# EAGLE schematic STM32_CAN-USB (EAGLE 7.5.0)
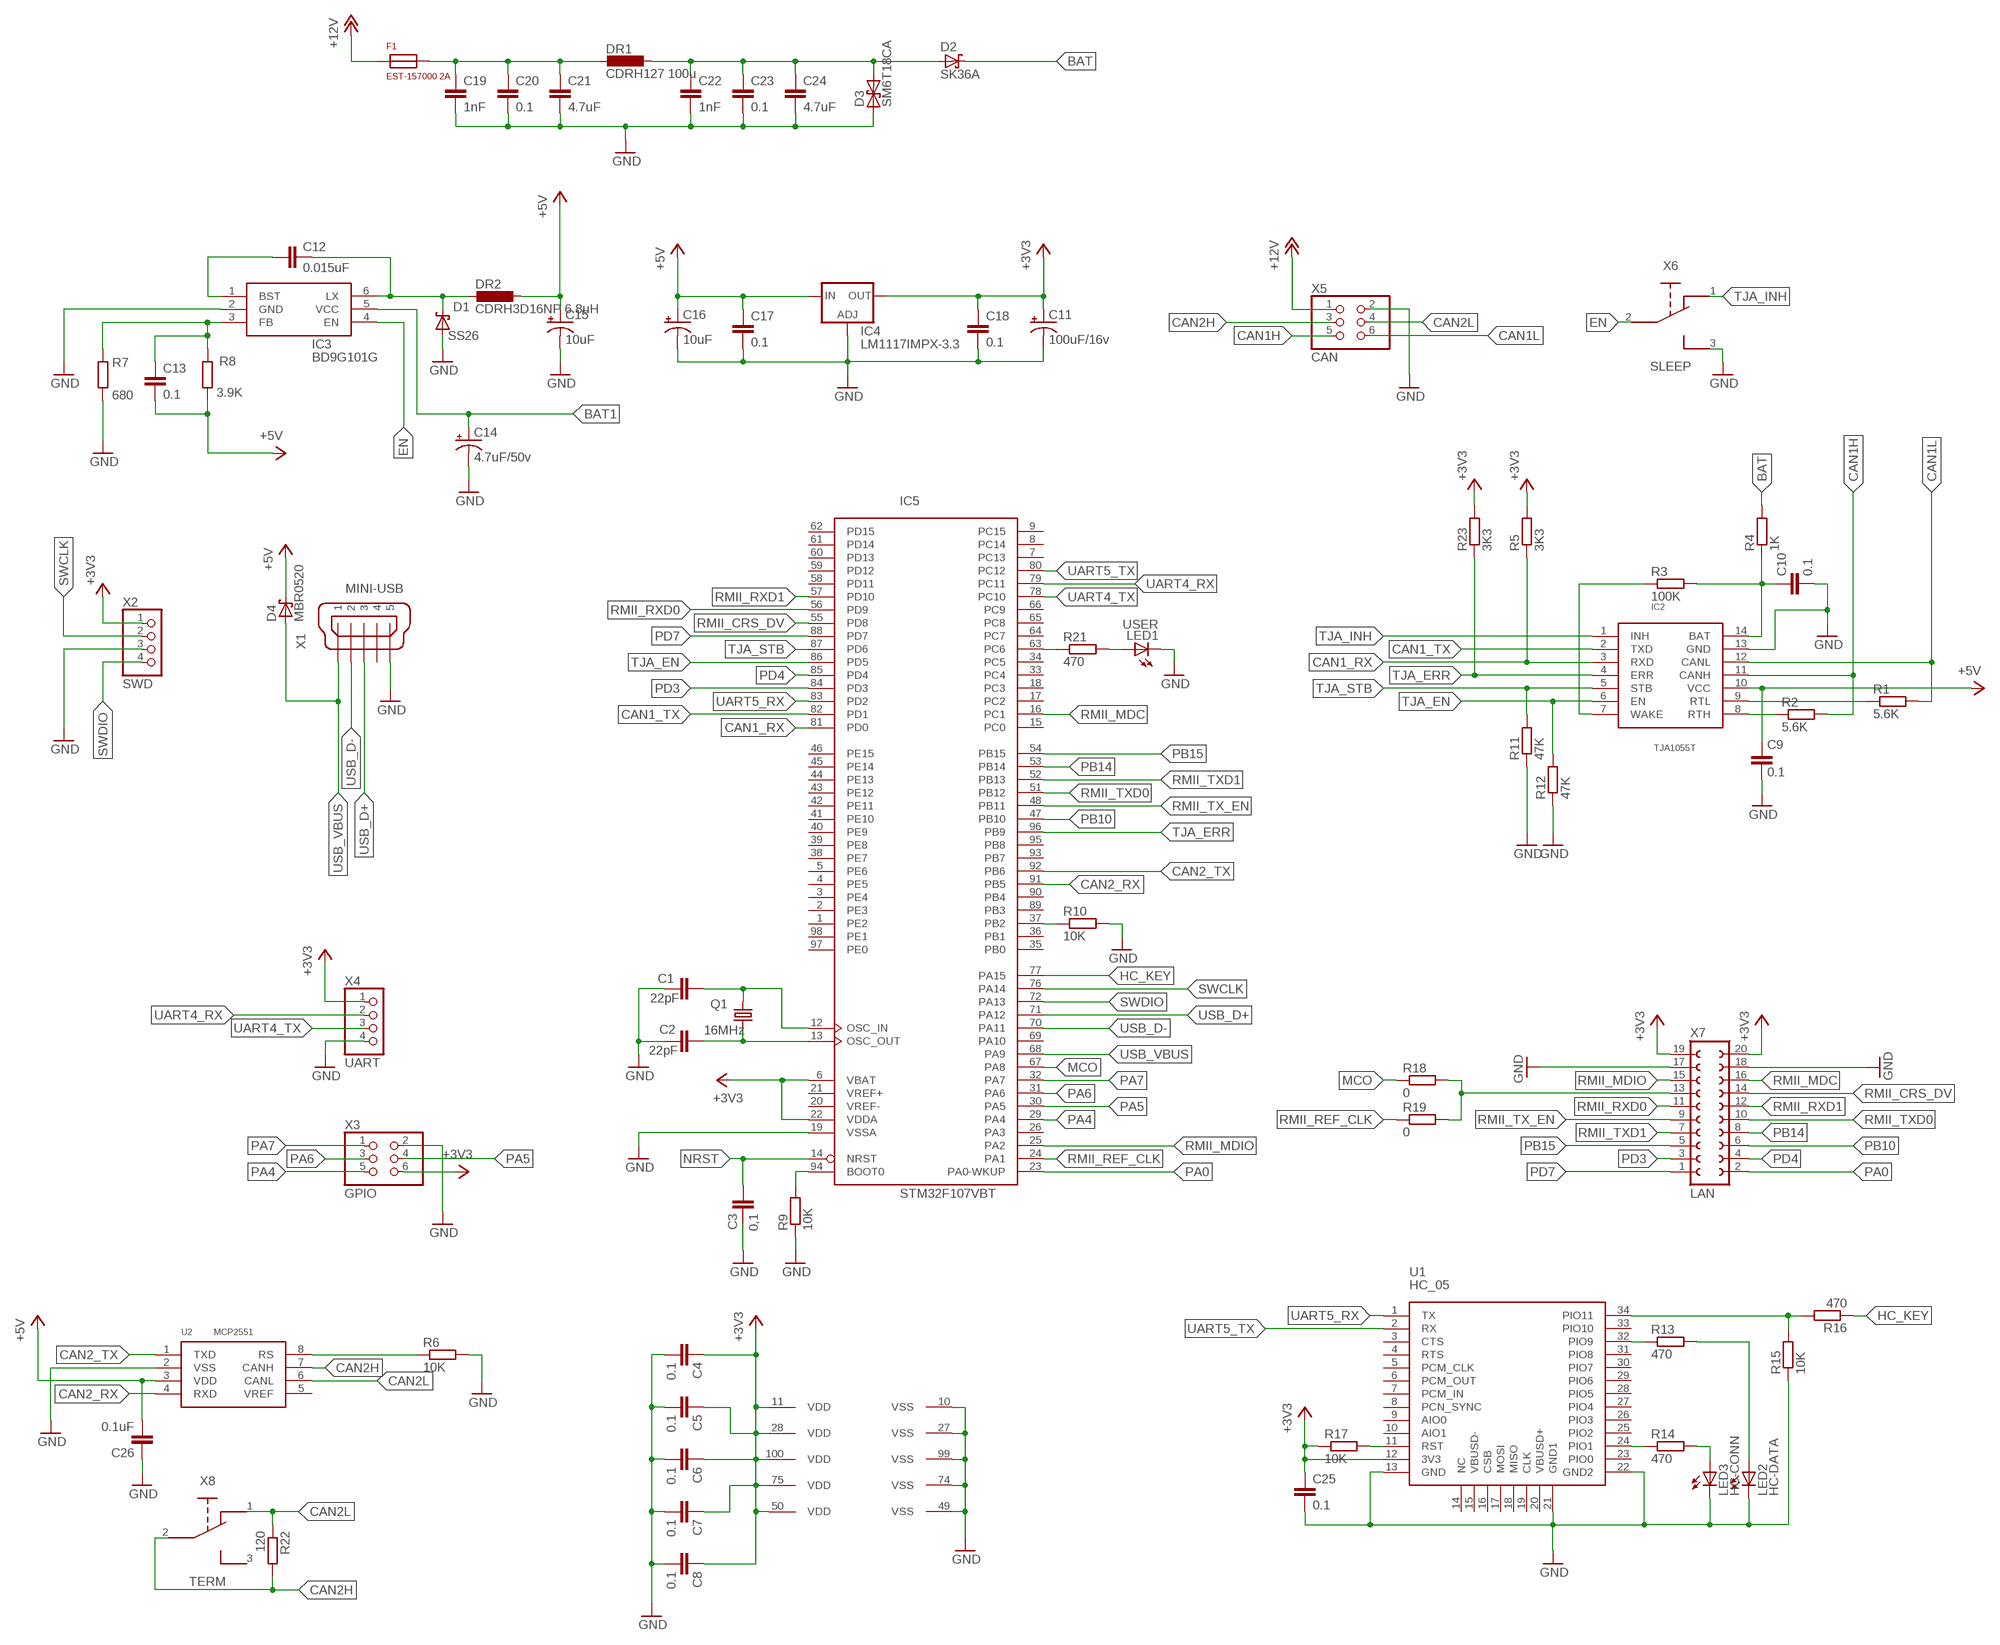
[diagram p0: schematic, sheet 1]

## Parts
C1  22pF  C-EUC0805  [C0805]
C2  22pF  C-EUC0805  [C0805]
C3  0,1  C-EUC0805  [C0805]
C4  0.1  C-EUC0805  [C0805]
C5  0.1  C-EUC0805  [C0805]
C6  0.1  C-EUC0805  [C0805]
C7  0.1  C-EUC0805  [C0805]
C8  0.1  C-EUC0805  [C0805]
C9  0.1  C-EUC0805  [C0805]
C10  0.1  C-EUC0805  [C0805]
C11  100uF/16v  CPOL-US153CLV-0605  [153CLV-0605]
C12  0.015uF  C-EUC0805  [C0805]
C13  0.1  C-EUC0805  [C0805]
C14  4.7uF/50v  CPOL-US153CLV-0605  [153CLV-0605]
C15  10uF  CPOL-US153CLV-0605  [153CLV-0605]
C16  10uF  CPOL-US153CLV-0605  [153CLV-0605]
C17  0.1  C-EUC0805  [C0805]
C18  0.1  C-EUC0805  [C0805]
C19  1nF  C-EUC0805  [C0805]
C20  0.1  C-EUC0805  [C0805]
C21  4.7uF  C-EUC0805  [C0805]
C22  1nF  C-EUC0805  [C0805]
C23  0.1  C-EUC0805  [C0805]
C24  4.7uF  C-EUC0805  [C0805]
C25  0.1  C-EUC0805  [C0805]
C26  0.1uF  C-EUC0805  [C0805]
D1  SS26  SCHOTTKY-DIODESMD  [SMB]
D2  SK36A  [DO-214AC]
D3  SM6T18CA  [DO214AA]
D4  MBR0520  [SOD123]
DR1  CDRH127 100u  CDRH127  [MS85]
DR2  CDRH3D16NP 6.8uH  CDRH3D16NP  [CDRH3D16NP]
F1  EST-157000 2A  FUSE  [FUSE]
IC2  TJA1055T  TJA1054T  [SO-14W]
IC3  BD9G101G  [SSOP6]
IC4  LM1117IMPX-3.3  [SOT223]
IC5  STM32F107VBT  [LQFP100]
LED1  USER  LED3MM  [LED3MM]
LED2  HC-DATA  LED3MM  [LED3MM]
LED3  HC-CONN  LED3MM  [LED3MM]
Q1  16MHz  CRYSTALHC49UP  [HC49UP]
R1  5.6K  R-EU_R0805  [R0805]
R2  5.6K  R-EU_R0805  [R0805]
R3  100K  R-EU_R0805  [R0805]
R4  1K  R-EU_R0805  [R0805]
R5  3K3  R-EU_R0805  [R0805]
R6  10K  R-EU_R0805  [R0805]
R7  680  R-EU_R0805  [R0805]
R8  3.9K  R-EU_R0805  [R0805]
R9  10K  R-EU_R0805  [R0805]
R10  10K  R-EU_R0805  [R0805]
R11  47K  R-EU_R0805  [R0805]
R12  47K  R-EU_R0805  [R0805]
R13  470  R-EU_R0805  [R0805]
R14  470  R-EU_R0805  [R0805]
R15  10K  R-EU_R0805  [R0805]
R16  470  R-EU_R0805  [R0805]
R17  10K  R-EU_R0805  [R0805]
R18  0  R-EU_R0805  [R0805]
R19  0  R-EU_R0805  [R0805]
R21  470  R-EU_R0805  [R0805]
R22  120  R-EU_R0805  [R0805]
R23  3K3  R-EU_R0805  [R0805]
U1  HC_05  [BLUETOOTH_SMD]
U2  MCP2551  INTERFACE-MCP2551-I/SN(SOIC8)  [SO08]
X1  MINI-USB  MINI-USB-UX60-MB-5ST  [UX60-MB-5ST]
X2  SWD  PINHD-1X4  [1X04]
X3  GPIO  PINHD-2X3/90  [2X03/90]
X4  UART  PINHD-1X4/90  [1X04/90]
X5  CAN  PINHD-2X3/90  [2X03/90]
X6  SLEEP  SS12F27  [SS12F27]
X7  LAN  FE10-2W  [FE10-2W]
X8  TERM  SS12F27  [SS12F27]

## Nets
+3V3: C4.1 C5.1 C6.1 C7.1 C8.1 C11.+ C18.1 C25.1 IC4.2(OUT) IC4.4(OUT) IC5.6(VBAT) IC5.11(VDD) IC5.22(VDDA) IC5.28(VDD) IC5.50(VDD) IC5.75(VDD) IC5.100(VDD) R5.2 R17.1 R23.2 U1.12(3V3) X2.1 X3.6 X4.1 X7.19 X7.20
+5V: C9.1 C13.2 C15.+ C16.+ C17.1 C26.2 D4.C DR2.P$2 IC2.10(VCC) IC4.3(IN) R8.1 U2.3(VDD)
+12V: F1.P$1 X5.1
BAT: D2.C R4.2
BAT1: C14.+ C22.1 C23.1 C24.1 D2.A D3.C DR1.P$2 IC3.5(VCC)
BD9-FB: C13.1 IC3.3(FB) R7.2 R8.2
CAN1_RX: IC2.3(RXD) IC5.81(PD0) R5.1
CAN1_TX: IC2.2(TXD) IC5.82(PD1)
CAN1H: IC2.11(CANH) R2.2 X5.5
CAN1L: IC2.12(CANL) R1.2 X5.6
CAN2_RX: IC5.91(PB5) U2.4(RXD)
CAN2_TX: IC5.92(PB6) U2.1(TXD)
CAN2H: R22.2 U2.7(CANH) X5.3 X8.2
CAN2L: R22.1 U2.6(CANL) X5.4 X8.1
EN: IC3.4(EN) X6.2
GND: C1.2 C2.2 C3.1 C4.2 C5.2 C6.2 C7.2 C8.2 C9.2 C10.2 C11.- C14.- C15.- C16.- C17.2 C18.2 C19.2 C20.2 C21.2 C22.2 C23.2 C24.2 C25.2 C26.1 D1.A D3.A IC2.13(GND) IC3.2(GND) IC4.1(ADJ) IC5.10(VSS) IC5.19(VSSA) IC5.27(VSS) IC5.49(VSS) IC5.74(VSS) IC5.99(VSS) LED1.K(C) LED2.K(C) LED3.K(C) R6.2 R7.1 R9.1 R10.2 R11.1 R12.1 R15.1 U1.13(GND) U1.21(GND1) U1.22(GND2) U2.2(VSS) X1.5 X1.M1 X1.M2 X2.3 X3.2 X4.4 X5.2 X6.3 X7.17 X7.18
HC_KEY: IC5.77(PA15) R16.1
MCO: IC5.67(PA8) R18.1
N$1: C1.1 IC5.12(OSC_IN) Q1.2
N$2: C2.1 IC5.13(OSC_OUT) Q1.1
N$3: IC5.94(BOOT0) R9.2
N$4: IC5.37(PB2) R10.1
N$5: R6.1 U2.8(RS)
N$6: IC5.63(PC6) R21.1
N$7: IC2.8(RTH) R2.1
N$8: IC2.9(RTL) R1.1
N$9: C12.1 IC3.1(BST)
N$12: C12.2 D1.C DR2.P$1 IC3.6(LX)
N$14: LED1.A R21.2
N$18: C19.1 C20.1 C21.1 DR1.P$1 F1.P$2
N$20: R13.1 U1.32(PIO9)
N$21: R14.1 U1.24(PIO1)
N$22: LED2.A R13.2
N$23: LED3.A R14.2
N$24: R17.2 U1.11(RST)
N$25: R15.2 R16.2 U1.34(PIO11)
N$37: R18.2 R19.2 X7.13
NRST: C3.2 IC5.14(NRST)
PA0: IC5.23(PA0-WKUP) X7.2
PA4: IC5.29(PA4) X3.5
PA5: IC5.30(PA5) X3.4
PA6: IC5.31(PA6) X3.3
PA7: IC5.32(PA7) X3.1
PB10: IC5.47(PB10) X7.6
PB14: IC5.53(PB14) X7.8
PB15: IC5.54(PB15) X7.5
PD3: IC5.84(PD3) X7.3
PD4: IC5.85(PD4) X7.4
PD7: IC5.88(PD7) X7.1
RMII_CRS_DV: IC5.55(PD8) X7.14
RMII_MDC: IC5.16(PC1) X7.16
RMII_MDIO: IC5.25(PA2) X7.15
RMII_REF_CLK: IC5.24(PA1) R19.1
RMII_RXD0: IC5.56(PD9) X7.11
RMII_RXD1: IC5.57(PD10) X7.12
RMII_TX_EN: IC5.48(PB11) X7.9
RMII_TXD0: IC5.51(PB12) X7.10
RMII_TXD1: IC5.52(PB13) X7.7
SWCLK: IC5.76(PA14) X2.2
SWDIO: IC5.72(PA13) X2.4
TJA_EN: IC2.6(EN) IC5.86(PD5) R12.2
TJA_ERR: IC2.4(ERR) IC5.96(PB9) R23.1
TJA_INH: IC2.1(INH) X6.1
TJA_STB: IC2.5(STB) IC5.87(PD6) R11.2
TJABAT: C10.1 IC2.14(BAT) R3.2 R4.1
TJAWAKE: IC2.7(WAKE) R3.1
UART4_RX: IC5.79(PC11) X4.2
UART4_TX: IC5.78(PC10) X4.3
UART5_RX: IC5.83(PD2) U1.1(TX)
UART5_TX: IC5.80(PC12) U1.2(RX)
USB_D+: IC5.71(PA12) X1.3
USB_D-: IC5.70(PA11) X1.2
USB_VBUS: D4.A IC5.68(PA9) X1.1
Unconnected: IC5.1(PE2) IC5.2(PE3) IC5.3(PE4) IC5.4(PE5) IC5.5(PE6) IC5.7(PC13) IC5.8(PC14) IC5.9(PC15) IC5.15(PC0) IC5.17(PC2) IC5.18(PC3) IC5.26(PA3) IC5.33(PC4) IC5.34(PC5) IC5.35(PB0) IC5.36(PB1) IC5.38(PE7) IC5.39(PE8) IC5.40(PE9) IC5.41(PE10) IC5.42(PE11) IC5.43(PE12) IC5.44(PE13) IC5.45(PE14) IC5.46(PE15) IC5.58(PD11) IC5.59(PD12) IC5.60(PD13) IC5.61(PD14) IC5.62(PD15) IC5.64(PC7) IC5.65(PC8) IC5.66(PC9) IC5.69(PA10) IC5.89(PB3) IC5.90(PB4) IC5.93(PB7) IC5.95(PB8) IC5.97(PE0) IC5.98(PE1) U1.3(CTS) U1.4(RTS) U1.5(PCM_CLK) U1.6(PCM_OUT) U1.7(PCM_IN) U1.8(PCN_SYNC) U1.9(AIO0) U1.10(AIO1) U1.14(NC) U1.15(VBUSD-) U1.16(CSB) U1.17(MOSI) U1.18(MISO) U1.19(CLK) U1.20(VBUSD+) U1.23(PIO0) U1.25(PIO2) U1.26(PIO3) U1.27(PIO4) U1.28(PIO5) U1.29(PIO6) U1.30(PIO7) U1.31(PIO8) U1.33(PIO10) U2.5(VREF) X1.4 X8.3

## Power pins joined to a net without a drawn wire
VREF+: IC5.21(VREF+)
VREF-: IC5.20(VREF-)

## Library data of the parts
C1-C10 C12 C13 C17-C26 = rcl:C-EU: CAPACITOR, European symbol
C11 C14-C16 = rcl:CPOL-US: POLARIZED CAPACITOR, American symbol
D1 = STM32_CAN-USB:SCHOTTKY-DIODE: Schottky Diode
D2 = STM32_CAN-USB:SK36A
D3 = STM32_CAN-USB:SM6T18CA
D4 = STM32_CAN-USB:MBR0520
DR1 = STM32_CAN-USB:CDRH127
DR2 = STM32_CAN-USB:CDRH3D16NP
F1 = STM32_CAN-USB:FUSE
IC2 = STM32_CAN-USB:TJA1054T
IC3 = STM32_CAN-USB:BD9G101G
IC4 = STM32_CAN-USB:LM1117IMPX-3.3
IC5 = micro-stm_v2:STM32F107V*T: ARM 32-bit Cortex™-M3 CPU 72 MHz maximum frequency 128 to 256 Kbytes of Flash memory 64 kbytes of SRAM 80 GPIOs 2.0 to 3.6 V application supply
LED1-LED3 = led:LED: LED OSRAM: - CHIPLED LG R971, LG N971, LY N971, LG Q971, LY Q971, LO R971, LY R971 LH N974, LH R974 LS Q976, LO Q976, LY Q976 LO Q996 - Hyper CHIPLED LW Q18S LB Q993, LB Q99A, LB R99A - SideLED LS A670, LO A670, LY A670, LG A670, LP A670 LB A673, LV A673, LT A673, LW A673 LH A674 LY A675 LS A676, LA A676, LO A676, LY A676, LW A676 LS A679, LY A679, LG A679 - Hyper Micro SIDELED® LS Y876, LA Y876, LO Y876, LY Y876 LT Y87S - SmartLED LW L88C, LW L88S LB L89C, LB L89S, LG L890 LS L89K, LO L89K, LY L89K LS L896, LA L896, LO L896, LY L896 - TOPLED LS T670, LO T670, LY T670, LG T670, LP T670 LSG T670, LSP T670, LSY T670, LOP T670, LYG T670 LG T671, LOG T671, LSG T671 LB T673, LV T673, LT T673, LW T673 LH T674 LS T676, LA T676, LO T676, LY T676, LB T676, LH T676, LSB T676, LW T676 LB T67C, LV T67C, LT T67C, LS T67K, LO T67K, LY T67K, LW E67C LS E67B, LA E67B, LO E67B, LY E67B, LB E67C, LV E67C, LT E67C LW T67C LS T679, LY T679, LG T679 LS T770, LO T770, LY T770, LG T770, LP T770 LB T773, LV T773, LT T773, LW T773 LH T774 LS E675, LA E675, LY E675, LS T675 LS T776, LA T776, LO T776, LY T776, LB T776 LHGB T686 LT T68C, LB T68C - Hyper Mini TOPLED® LB M676 - Mini TOPLED Santana® LG M470 LS M47K, LO M47K, LY M47K Source: http://www.osram.convergy.de LUXEON: - LUMILED® LXK2-PW12-R00, LXK2-PW12-S00, LXK2-PW14-U00, LXK2-PW14-V00 LXK2-PM12-R00, LXK2-PM12-S00, LXK2-PM14-U00 LXK2-PE12-Q00, LXK2-PE12-R00, LXK2-PE12-S00, LXK2-PE14-T00, LXK2-PE14-U00 LXK2-PB12-K00, LXK2-PB12-L00, LXK2-PB12-M00, LXK2-PB14-N00, LXK2-PB14-P00, LXK2-PB14-Q00 LXK2-PR12-L00, LXK2-PR12-M00, LXK2-PR14-Q00, LXK2-PR14-R00 LXK2-PD12-Q00, LXK2-PD12-R00, LXK2-PD12-S00 LXK2-PH12-R00, LXK2-PH12-S00 LXK2-PL12-P00, LXK2-PL12-Q00, LXK2-PL12-R00 Source: www.luxeon.com KINGBRIGHT: KA-3528ASYC Source: www.kingbright.com
Q1 = crystal:CRYSTAL: CRYSTAL; OC_FARNELL: unknown; OC_NEWARK: unknown
R1-R19 R21-R23 = rcl:R-EU_: RESISTOR, European symbol
U1 = Bluetooth HC-05:HC_05: HC-05 Bluetooth Module
U2 = CAN_Shiel_Lib:INTERFACE-MCP2551-I/SN(SOIC8): 310070024; MPN: MCP2551-I/SN; VALUE: MCP2551-I/SN-SOIC8
X1 = STM32_CAN-USB:MINI-USB-: MINI USB Connector Source: http://www.hirose.co.jp/cataloge_hp/e24000019.pdf; OC_FARNELL: unknown; OC_NEWARK: unknown
X2 X4 = pinhead:PINHD-1X4: PIN HEADER
X3 X5 = pinhead:PINHD-2X3: PIN HEADER
X6 X8 = STM32_CAN-USB:SS12F27
X7 = con-lsta:FE10-2W: FEMALE HEADER; OC_FARNELL: unknown; OC_NEWARK: unknown